# Altium project D_Project.PrjPcb (part 3 of 3)
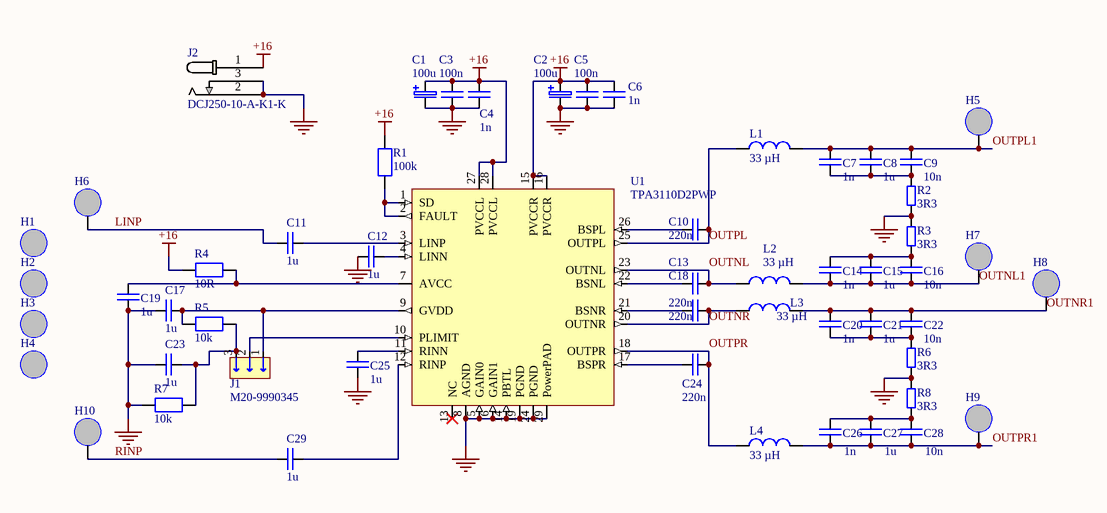
[diagram p2: D_amp_Schem.SchDoc]

## Sheet D_amp_Schem.SchDoc (continued)

### Library data of the parts (continued)
U1 = TPA3110D2PWP: Audio Amp Speaker 2-CH Stereo 15W Class-D 28-Pin HTSSOP EP Tube; Manufacturer: Texas Instruments; Manufacturer Lifecycle Status: ACTIVE; Gain: 36dB; Load Impedance: 4Ω; Max Power Dissipation: 4.48W; Max Supply Voltage: 26V; Min Supply Voltage: 8V; Nominal Supply Current: 32mA; Number of Channels: 2; Operating Supply Voltage: 15V; Supply Type: Single; Supplier: Arrow Electronics; Supplier Part Number: TPA3110D2PWP; Manufacturer Part Number: TPA3110D2PWP; RoHS: Compliant; Category: Amplifiers - Audio; Stock: 250; Pricing: 50=1,5401, 100=1,4378, 250=1,3687 (USD); Case/Package: HTSSOP EP; Contact Plating: Gold; Height: 1.2mm; Lead Free: Lead Free; Length: 9.7mm; Lifecycle Status: Production; Max Operating Temperature: 85°C; Max Output Power: 15W; Min Operating Temperature: -40°C; Pins: 28; Output Power: 15W; Power Dissipation: 4.48W; Radiation Hardening: No; REACH SVHC: No; Schedule B: 8542330000, 8542330000|8542330000|8542330000|8542330000|8542330000; Thickness: 1mm; Voltage Gain: 36dB; Width: 4.4mm; ComponentLink1URL: https://sigma.octopart.com:443/149651771/technical_drawing/Texas-Instruments-TPA3110D2PWP.pdf?src-supplier=Texas+Instruments; ComponentLink1Description: https://sigma.octopart.com:443/149651771/technical_drawing/Texas-Instruments-TPA3110D2PWP.pdf?src-supplier=Texas+Instruments; ComponentLink2URL: https://octopart.com:443/opatz8j6/c1?t=9VHQkCeyPoh3DPMAEO_DFo9LJb0sepxuhZqDcO3kNn-hr1I6CpSxn9kX-i7iwNW1QQ_FN3-6OiNrwOctxpZjiE5mK9kpTyXxb_K8QBkQ4FiC-fcvIhxPQqWrd8GZ9PALWuLWiXKfwAYsJ8ZGWNDJfECj5kWpDTYvS6oUPIgRtk3L4fHRzyDudR_Z5pmWaveG_BBIkZ83n_fZiEsPkwTBlDf9yGPm6kI-UHfL6X43OizeKqBVu1YbbkNF2nnE8vpO5NbVv8XYB0cGXcHluYXKMHSHWR7DfumS5WPtGaQJ0waGYKYvuduurNqcQleWD3Djxar4CBCeupFhl3JUWnQgj2JyMxpHzweSWShAO39dpy6sbNmcTfY9s9cWmFe3EZSCp8Jg4c5Xzw&src-supplier=Texas+Instruments; ComponentLink2Description: https://octopart.com:443/opatz8j6/c1?t=9VHQkCeyPoh3DPMAEO_DFo9LJb0sepxuhZqDcO3kNn-hr1I6CpSxn9kX-i7iwNW1QQ_FN3-6OiNrwOctxpZjiE5mK9kpTyXxb_K8QBkQ4FiC-fcvIhxPQqWrd8GZ9PALWuLWiXKfwAYsJ8ZGWNDJfECj5kWpDTYvS6oUPIgRtk3L4fHRzyDudR_Z5pmWaveG_BBIkZ83n_fZiEsPkwTBlDf9yGPm6kI-UHfL6X43OizeKqBVu1YbbkNF2nnE8vpO5NbVv8XYB0cGXcHluYXKMHSHWR7DfumS5WPtGaQJ0waGYKYvuduurNqcQleWD3Djxar4CBCeupFhl3JUWnQgj2JyMxpHzweSWShAO39dpy6sbNmcTfY9s9cWmFe3EZSCp8Jg4c5Xzw&src-supplier=Texas+Instruments; ComponentLink3URL: https://datasheet.octopart.com:443/TPA3110D2PWP-Texas-Instruments-datasheet-11515068.pdf?src-supplier=Texas+Instruments; ComponentLink3Description: https://datasheet.octopart.com:443/TPA3110D2PWP-Texas-Instruments-datasheet-11515068.pdf?src-supplier=Texas+Instruments; ComponentLink4URL: https://datasheet.octopart.com:443/TPA3110D2PWP-Texas-Instruments-datasheet-10288525.pdf?src-supplier=Texas+Instruments; ComponentLink4Description: https://datasheet.octopart.com:443/TPA3110D2PWP-Texas-Instruments-datasheet-10288525.pdf?src-supplier=Texas+Instruments; ComponentLink5URL: https://sigma.octopart.com:443/49250896/technical_drawing/Texas-Instruments-TPA3110D2PWP.pdf?src-supplier=Texas+Instruments; ComponentLink5Description: https://sigma.octopart.com:443/49250896/technical_drawing/Texas-Instruments-TPA3110D2PWP.pdf?src-supplier=Texas+Instruments; ComponentLink6URL: https://datasheet.octopart.com:443/TPA3110D2PWP-Texas-Instruments-datasheet-37738469.pdf?src-supplier=element14+APAC; ComponentLink6Description: https://datasheet.octopart.com:443/TPA3110D2PWP-Texas-Instruments-datasheet-37738469.pdf?src-supplier=element14+APAC; ComponentLink7URL: https://datasheet.octopart.com:443/TPA3110D2PWP-Texas-Instruments-datasheet-159117886.pdf?src-supplier=EBEE; ComponentLink7Description: https://datasheet.octopart.com:443/TPA3110D2PWP-Texas-Instruments-datasheet-159117886.pdf?src-supplier=EBEE; ComponentLink8URL: https://datasheet.octopart.com:443/TPA3110D2PWP-Texas-Instruments-datasheet-102499862.pdf?src-supplier=Newark; ComponentLink8Description: https://datasheet.octopart.com:443/TPA3110D2PWP-Texas-Instruments-datasheet-102499862.pdf?src-supplier=Newark; ComponentLink9URL: https://datasheet.octopart.com:443/TPA3110D2PWP-Texas-Instruments-datasheet-33012572.pdf?src-supplier=Newark; ComponentLink9Description: https://datasheet.octopart.com:443/TPA3110D2PWP-Texas-Instruments-datasheet-33012572.pdf?src-supplier=Newark; ComponentLink10URL: https://datasheet.octopart.com:443/TPA3110D2PWP-Texas-Instruments-datasheet-14135493.pdf?src-supplier=iiiC; ComponentLink10Description: https://datasheet.octopart.com:443/TPA3110D2PWP-Texas-Instruments-datasheet-14135493.pdf?src-supplier=iiiC; ComponentLink11URL: https://datasheet.octopart.com:443/TPA3110D2PWP-Texas-Instruments-datasheet-10979497.pdf?src-supplier=Farnell; ComponentLink11Description: https://datasheet.octopart.com:443/TPA3110D2PWP-Texas-Instruments-datasheet-10979497.pdf?src-supplier=Farnell; ComponentLink12URL: https://datasheet.octopart.com:443/TPA3110D2PWP-Texas-Instruments-datasheet-8360863.pdf?src-supplier=Farnell; ComponentLink12Description: https://datasheet.octopart.com:443/TPA3110D2PWP-Texas-Instruments-datasheet-8360863.pdf?src-supplier=Farnell; ComponentLink13URL: http://sigma.octopart.com:80/reach_statement/Texas-Instruments-company-64.pdf?src-supplier=Compliance+Statements; ComponentLink13Description: http://sigma.octopart.com:80/reach_statement/Texas-Instruments-company-64.pdf?src-supplier=Compliance+Statements; ComponentLink14URL: http://sigma.octopart.com:80/conflict_mineral_statement/Texas-Instruments-company-63.pdf?src-supplier=Compliance+Statements; ComponentLink14Description: http://sigma.octopart.com:80/conflict_mineral_statement/Texas-Instruments-company-63.pdf?src-supplier=Compliance+Statements